# EAGLE design main (EAGLE 7.2.0)
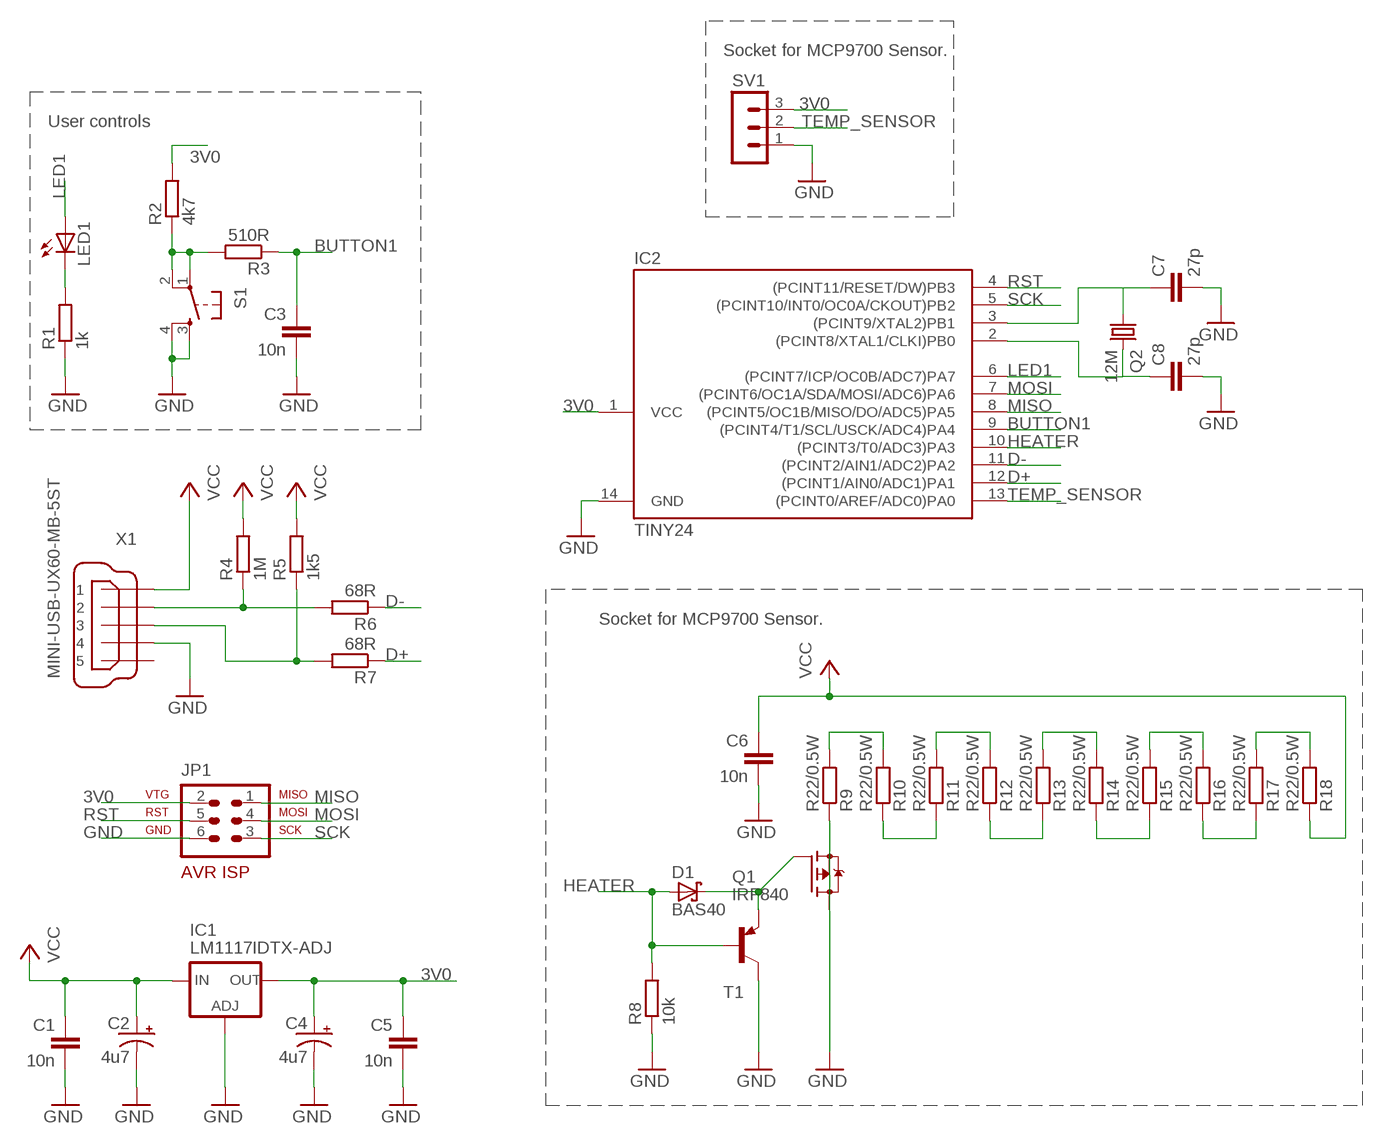
[diagram p0: schematic, sheet 1]

## Parts
C1  10n  C-EUC1206  [C1206]
C2  4u7  CPOL-USA/3216-18W  [A/3216-18W]
C3  10n  C-EUC1206  [C1206]
C4  4u7  CPOL-USA/3216-18W  [A/3216-18W]
C5  10n  C-EUC1206  [C1206]
C6  10n  C-EUC1206  [C1206]
C7  27p  C-EU025-024X044  [C025-024X044]
C8  27p  C-EU025-024X044  [C025-024X044]
D1  BAS40  [SOT23]
IC1  LM1117IDTX-ADJ  [TO252]
IC2  TINY24  TINY24/44/84-PU  [DIL14]
JP1  AVR-ISP-6  [AVR-ISP-6]
LED1  LEDCHIP-LED0805  [CHIP-LED0805]
Q1  IRF840  SPD30P06PTO252  [TO252]
Q2  12M  CRYTALHC18U-V  [HC18U-V]
R1  1k  R-EU_R1206  [R1206]
R2  4k7  R-EU_R1206  [R1206]
R3  510R  R-EU_R1206  [R1206]
R4  1M  R-EU_R1206  [R1206]
R5  1k5  R-EU_R1206  [R1206]
R6  68R  R-EU_R1206  [R1206]
R7  68R  R-EU_R1206  [R1206]
R8  10k  R-EU_R1206  [R1206]
R9  R22/0.5W  R-EU_0207/12  [0207/12]
R10  R22/0.5W  R-EU_0207/12  [0207/12]
R11  R22/0.5W  R-EU_0207/12  [0207/12]
R12  R22/0.5W  R-EU_0207/12  [0207/12]
R13  R22/0.5W  R-EU_0207/12  [0207/12]
R14  R22/0.5W  R-EU_0207/12  [0207/12]
R15  R22/0.5W  R-EU_0207/12  [0207/12]
R16  R22/0.5W  R-EU_0207/12  [0207/12]
R17  R22/0.5W  R-EU_0207/12  [0207/12]
R18  R22/0.5W  R-EU_0207/12  [0207/12]
S1  TAC_SWITCHPTH  [TACTILE-PTH]
SV1  MA03-1  [MA03-1]
T1  BC807-40-PNP-SOT23-BEC  [SOT23-BEC]
X1  MINI-USB-UX60-MB-5ST  [UX60-MB-5ST]

## Nets
3V0: C4.+ C5.1 IC1.TAB(OUT) IC2.1(VCC) JP1.2 R2.2 SV1.3
BUTTON1: C3.1 IC2.9((PCINT4/T1/SCL/USCK/ADC4)PA4) R3.1
D+: IC2.12((PCINT1/AIN0/ADC1)PA1) R7.1
D-: IC2.11((PCINT2/AIN1/ADC2)PA2) R6.1
GND: C1.2 C2.- C3.2 C4.- C5.2 C6.2 C7.2 C8.2 IC1.1(ADJ) IC2.14(GND) JP1.6 Q1.2(S) R1.1 R8.1 S1.3 S1.4 SV1.1 T1.C X1.4
HEATER: D1.1(A) IC2.10((PCINT3/T0/ADC3)PA3) R8.2 T1.B
LED1: IC2.6((PCINT7/ICP/OC0B/ADC7)PA7) LED1.A
MISO: IC2.8((PCINT5/OC1B/MISO/DO/ADC5)PA5) JP1.1
MOSI: IC2.7((PCINT6/OC1A/SDA/MOSI/ADC6)PA6) JP1.4
N$1: R4.1 R6.2 X1.2
N$2: Q1.3(D) R9.1
N$3: R5.1 R7.2 X1.3
N$4: C7.1 IC2.3((PCINT9/XTAL2)PB1) Q2.1
N$5: R9.2 R10.2
N$6: R2.1 R3.2 S1.1 S1.2
N$7: R10.1 R11.1
N$8: R11.2 R12.2
N$9: R12.1 R13.1
N$10: R13.2 R14.2
N$11: R14.1 R15.1
N$12: R15.2 R16.2
N$13: R16.1 R17.1
N$14: LED1.C R1.2
N$16: D1.3(C) Q1.1(G) T1.E
N$17: R17.2 R18.2
PB0: C8.1 IC2.2((PCINT8/XTAL1/CLKI)PB0) Q2.2
RST: IC2.4((PCINT11/RESET/DW)PB3) JP1.5
SCK: IC2.5((PCINT10/INT0/OC0A/CKOUT)PB2) JP1.3
TEMP_SENSOR: IC2.13((PCINT0/AREF/ADC0)PA0) SV1.2
VCC: C1.1 C2.+ C6.1 IC1.2(IN) R4.2 R5.2 R18.1 X1.1
Unconnected: X1.5

## Notes on the sheet
- Socket for MCP9700 Sensor.
- User controls
- Socket for MCP9700 Sensor.

## Library data of the parts
C1 C3 C5-C8 = resistor:C-EU: CAPACITOR, European symbol
C2 C4 = resistor:CPOL-US: POLARIZED CAPACITOR, American symbol
D1 = diode:BAS40: Silicon Schottky Diodes General-purpose diode for high-speed switching
IC1 = lm1117:LM1117IDTX-ADJ
IC2 = avr-5:TINY24/44/84
JP1 = avr-5:AVR-ISP-6: AVR ISP-6 Serial Programming Header
LED1 = led:LED: LED OSRAM: - CHIPLED LG R971, LG N971, LY N971, LG Q971, LY Q971, LO R971, LY R971 LH N974, LH R974 LS Q976, LO Q976, LY Q976 LO Q996 - Hyper CHIPLED LW Q18S LB Q993, LB Q99A, LB R99A - SideLED LS A670, LO A670, LY A670, LG A670, LP A670 LB A673, LV A673, LT A673, LW A673 LH A674 LY A675 LS A676, LA A676, LO A676, LY A676, LW A676 LS A679, LY A679, LG A679 - Hyper Micro SIDELED® LS Y876, LA Y876, LO Y876, LY Y876 LT Y87S - SmartLED LW L88C, LW L88S LB L89C, LB L89S, LG L890 LS L89K, LO L89K, LY L89K LS L896, LA L896, LO L896, LY L896 - TOPLED LS T670, LO T670, LY T670, LG T670, LP T670 LSG T670, LSP T670, LSY T670, LOP T670, LYG T670 LG T671, LOG T671, LSG T671 LB T673, LV T673, LT T673, LW T673 LH T674 LS T676, LA T676, LO T676, LY T676, LB T676, LH T676, LSB T676, LW T676 LB T67C, LV T67C, LT T67C, LS T67K, LO T67K, LY T67K, LW E67C LS E67B, LA E67B, LO E67B, LY E67B, LB E67C, LV E67C, LT E67C LW T67C LS T679, LY T679, LG T679 LS T770, LO T770, LY T770, LG T770, LP T770 LB T773, LV T773, LT T773, LW T773 LH T774 LS E675, LA E675, LY E675, LS T675 LS T776, LA T776, LO T776, LY T776, LB T776 LHGB T686 LT T68C, LB T68C - Hyper Mini TOPLED® LB M676 - Mini TOPLED Santana® LG M470 LS M47K, LO M47K, LY M47K Source: http://www.osram.convergy.de LUXEON: - LUMILED® LXK2-PW12-R00, LXK2-PW12-S00, LXK2-PW14-U00, LXK2-PW14-V00 LXK2-PM12-R00, LXK2-PM12-S00, LXK2-PM14-U00 LXK2-PE12-Q00, LXK2-PE12-R00, LXK2-PE12-S00, LXK2-PE14-T00, LXK2-PE14-U00 LXK2-PB12-K00, LXK2-PB12-L00, LXK2-PB12-M00, LXK2-PB14-N00, LXK2-PB14-P00, LXK2-PB14-Q00 LXK2-PR12-L00, LXK2-PR12-M00, LXK2-PR14-Q00, LXK2-PR14-R00 LXK2-PD12-Q00, LXK2-PD12-R00, LXK2-PD12-S00 LXK2-PH12-R00, LXK2-PH12-S00 LXK2-PL12-P00, LXK2-PL12-Q00, LXK2-PL12-R00 Source: www.luxeon.com KINGBRIGHT: KA-3528ASYC Source: www.kingbright.com
Q1 = transistor-fet:SPD30P06P: SIPMOS(R) Power-Transistor P-Channel, Enhancement mode Source: http://www.infineon.com/upload/Document/cmc_upload/documents/012/3615/SPD_U30P06P.pdf
Q2 = crystal:CRYTAL: CRYSTAL
R1-R18 = resistor:R-EU_: RESISTOR, European symbol
S1 = SparkFun:TAC_SWITCH: Momentary Switch Button commonly used for reset or general input. Spark Fun Electronics SKU : COM-00097
SV1 = con-lstb:MA03-1: PIN HEADER; OC_FARNELL: unknown; OC_NEWARK: unknown
T1 = transistor:*-PNP-: PNP Transistror
X1 = con-hirose:MINI-USB-: MINI USB Connector Source: http://www.hirose.co.jp/cataloge_hp/e24000019.pdf; OC_FARNELL: unknown; OC_NEWARK: unknown

## Net classes
1 hv: clearance 0.635 mm

## Board
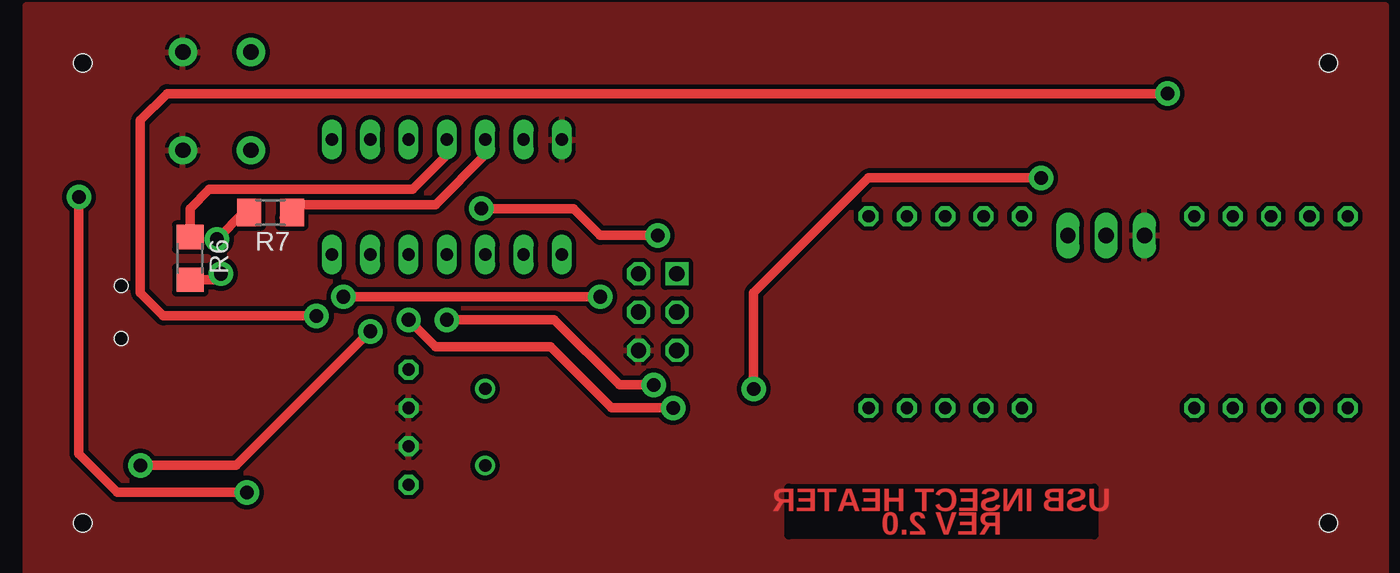
[diagram p1: board, top side]
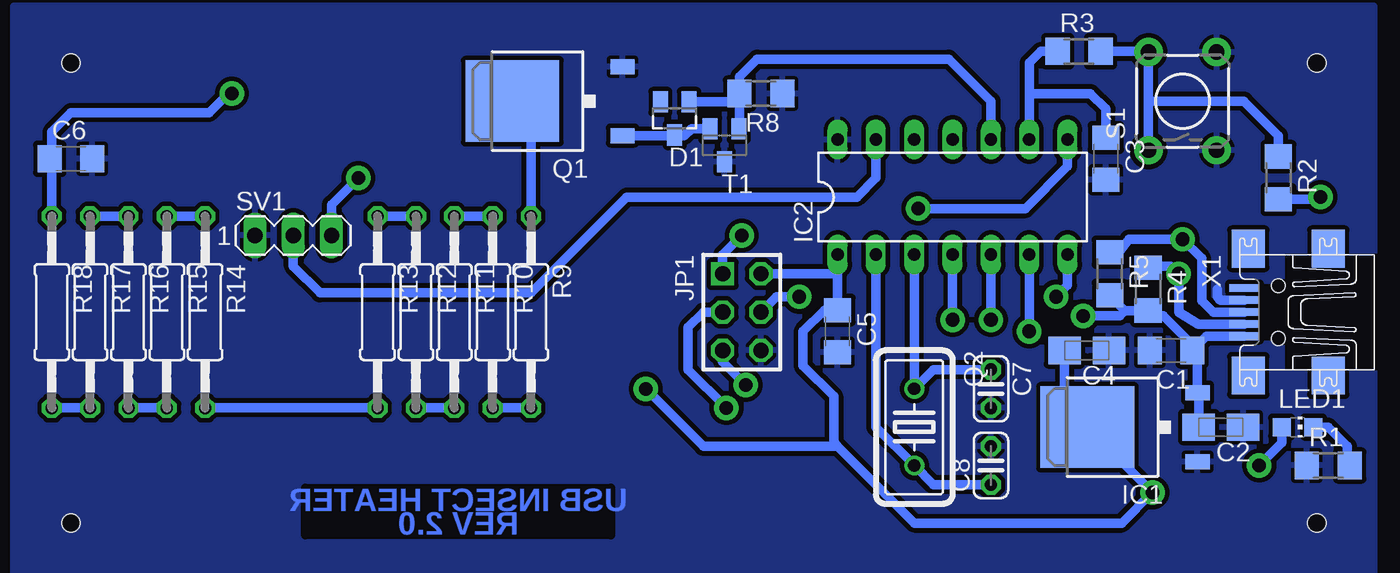
[diagram p2: board, bottom side, seen from below]

No outline drawn. Coordinates in mm, seen from the top.
Copper layers (1*16): Top 0.035mm / dielectric 1.5mm / Bottom 0.035mm
Design rules "default *": minimum track width 10mil, minimum drill 24mil, track to track 12mil, track to pad 12mil, pad to pad 8mil, via to via 8mil, smd to smd 8mil, copper to edge 0mil, drill to drill 8mil, minimum pad ring 10mil, minimum via ring 8mil, stop-mask expansion 4mil, vias tented up to drill 0mil, thermal gap 10mil
Holes 1.2 mm at 3.81,40.64 3.81,10.16 86.36,40.64 86.36,10.16

### Footprints (pad centres in the part's own frame; a part is rotated, then mirrored left to right if it is on the bottom)
C1206 = smd 1.6 x 1.8: 1 -1.4,0; 2 1.4,0
A/3216-18W = smd 2.15 x 1.8: + 1.475,0; - -1.475,0
C025-024X044 = drill 0.813 octagon: 1 -1.27,0; 2 1.27,0
SOT23 = smd 1 x 1.4: 1 -0.95,-1.1; 2 0.95,-1.1; 3 0,1.1
TO252 = smd 1 x 1.6: 1 -2.28,-4.8; 2 2.28,-4.8 | smd 5.4 x 6.2: TAB 0,2.5
DIL14 = drill 0.813 long: 1 -7.62,-3.81; 2 -5.08,-3.81; 3 -2.54,-3.81; 4 0,-3.81; 5 2.54,-3.81; 6 5.08,-3.81; 7 7.62,-3.81; 8 7.62,3.81; 9 5.08,3.81; 10 2.54,3.81; 11 0,3.81; 12 -2.54,3.81; 13 -5.08,3.81; 14 -7.62,3.81
AVR-ISP-6 = drill 1.016 square: 1 -2.54,-1.27 | drill 1.016 octagon: 2 -2.54,1.27; 3 0,-1.27; 4 0,1.27; 5 2.54,-1.27; 6 2.54,1.27
CHIP-LED0805 = smd 1.2 x 1.2: A 0,-1.05; C 0,1.05
TO252' = smd 1 x 1.6: 1 -2.28,-4.8; 2 2.28,-4.8 | smd 5.4 x 6.2: 3 0,2.5
HC18U-V = drill 0.813: 1 -2.54,0; 2 2.54,0
R1206 = smd 1.6 x 1.803: 1 -1.422,0; 2 1.422,0
0207/12 = drill 0.813 octagon: 1 -6.35,0; 2 6.35,0
TACTILE-PTH = drill 1.016 pad 1.88: 1 -3.251,2.261; 2 3.251,2.261; 3 -3.251,-2.261; 4 3.251,-2.261
MA03-1 = drill 1.016 long: 1 -2.54,0; 2 0,0; 3 2.54,0
SOT23-BEC = smd 1 x 1.4: B -0.95,-1.1; C 0,1.1; E 0.95,-1.1
UX60-MB-5ST = smd 2 x 0.5: 1 2.25,1.6; 2 2.25,0.8; 3 2.25,0; 4 2.25,-0.8; 5 2.25,-1.6 | smd 2.2 x 2.5: M1 -3.3,-4.2; M2 -3.3,4.2; M3 2,4.2; M4 2,-4.2 | hole 0.9: 0,-1.75; 0,1.75

### Placement (x,y rotation side)
C1  13.46,21.59 180 bottom
C2  10.16,16.51 180 bottom
C3  17.78,34.29 270 bottom
C4  19.05,21.59 180 bottom
C5  35.56,22.86 270 bottom
C6  86.36,34.29 0 bottom
C7  25.4,19.05 270 bottom
C8  25.4,13.97 90 bottom
D1  46.35,36.96 180 bottom
IC1  16.51,16.51 90 bottom
IC2  27.94,31.75 0 bottom
JP1  41.91,24.13 270 bottom
LED1  5.08,16.51 270 bottom
Q1  IRF840  [TO252']  54.61,38.1 90 bottom
Q2  30.48,16.51 270 bottom
R1  3.05,13.97 0 bottom
R2  6.35,33.02 270 bottom
R3  19.56,41.4 0 bottom
R4  14.99,25.65 270 bottom
R5  17.53,26.67 270 bottom
R6  10.92,27.69 270 top
R7  16.26,30.73 180 top
R8  40.64,38.61 180 bottom
R9  55.88,24.13 270 bottom
R10  58.42,24.13 270 bottom
R11  60.96,24.13 270 bottom
R12  63.5,24.13 270 bottom
R13  66.04,24.13 270 bottom
R14  77.47,24.13 270 bottom
R15  80.01,24.13 270 bottom
R16  82.55,24.13 270 bottom
R17  85.09,24.13 270 bottom
R18  87.63,24.13 270 bottom
S1  12.7,38.1 90 bottom
SV1  71.63,29.21 0 bottom
T1  43.05,35.18 180 bottom
X1  6.35,24.13 180 bottom

### Tracks (layer width: path | path; a pad name or v marks a point on that pad's centre or on a via)
3V0  (via drill 0.9)
  Top 0.635: v3.56,31.75 3.56,14.73 6.1,12.19 v14.69,12.19 | v67.31,33.02 55.88,33.02 48.26,25.4 v48.26,19.05
  Bottom 0.635: C4.+ 20.52,18.02 IC1.TAB v14.69,12.19 16.72,10.16 30.48,10.16 35.56,15.24 | 35.56,26.67 C5.1 36.45,24.26 37.85,22.86 37.85,20.57 35.81,18.54 35.81,15.49 35.56,15.24 | IC2.1 35.56,26.67 | 35.56,26.67 JP1.2 | R2.2 3.71,31.6 v3.56,31.75 | SV1.3 69.09,31.24 v67.31,33.02 | v48.26,19.05 44.45,15.24 35.56,15.24
BUTTON1
  Bottom 0.635: IC2.9 22.86,38.35 | 22.86,38.35 22.86,40.64 22.1,41.4 R3.1 | C3.1 17.78,37.59 18.8,38.61 22.61,38.61 22.86,38.35
D+
  Top 0.635: R7.1 17.17,30.38 18.03,31.24 27.18,31.24 30.48,34.54 IC2.12
D-
  Top 0.635: R6.1 10.92,30.99 12.19,32.26 25.65,32.26 27.94,34.54 IC2.11
GND
  Bottom 0.635: 8.89,16.3 C2.- | X1.4 10.2,24.93 10.41,25.15 10.41,25.65
  pour Bottom: 0,6.35 90.17,6.35 90.17,44.45 0,44.45
  pour Top: 0,6.35 90.17,6.35 90.17,44.45 0,44.45
HEATER
  Bottom 0.635: T1.B 42.06,36.32 42.06,38.1 | 42.06,38.1 R8.2 | R8.2 | D1.1 42.1,38.06 42.06,38.1 | R8.2 42.06,39.73 40.89,40.89 28.19,40.89 25.4,38.1 IC2.10
LED1  (via drill 0.9)
  Top 0.635: v7.62,13.97 13.97,13.97 v22.86,22.86
  Bottom 0.635: IC2.6 v22.86,22.86 | LED1.A 6.13,15.46 v7.62,13.97
MISO  (via drill 0.9)
  Top 0.635: v41.91,29.21 38.1,29.21 36.32,30.99 v30.23,30.99
  Bottom 0.635: JP1.1 43.18,27.94 v41.91,29.21 | v30.23,30.99 23.11,30.99 20.32,33.78 IC2.8
MOSI  (via drill 0.9)
  Top 0.635: v38.1,25.15 v21.08,25.15
  Bottom 0.635: JP1.4 39.62,25.15 v38.1,25.15 | v21.08,25.15 20.32,25.91 IC2.7
N$1  (via drill 0.9)
  Top 0.635: R6.2 12.55,26.26 v12.95,26.67
  Bottom 0.635: X1.2 11.65,23.33 12.95,24.13 v12.95,26.67 13.46,27.18 14.33,27.18 R4.1
N$2
  Bottom 0.635: R9.1 55.88,36.87 Q1.3
N$3  (via drill 0.9)
  Top 0.635: R7.2 14.48,30.73 v12.7,28.96
  Bottom 0.635: X1.3 10.67,24.13 11.43,24.89 11.43,27.69 v12.7,28.96 16.26,28.96 17.02,27.94 R5.1
N$4
  Bottom 0.635: C7.1 29.21,20.32 Q2.1 IC2.3
N$5
  Bottom 0.635: R9.2 R10.2
N$6
  Bottom 0.635: R3.2 15.01,41.4 S1.2 14.96,38.1 | 14.96,38.1 S1.1 | R2.1 6.35,35.81 8.64,38.1 14.96,38.1
N$7
  Bottom 0.635: R10.1 R11.1
N$8
  Bottom 0.635: R11.2 R12.2
N$9
  Bottom 0.635: R12.1 R13.1
N$10
  Bottom 0.635: R13.2 R14.2
N$11
  Bottom 0.635: R14.1 R15.1
N$12
  Bottom 0.635: R15.2 R16.2
N$13
  Bottom 0.635: R16.1 R17.1
N$14
  Bottom 0.635: LED1.C 3.05,16.51 1.78,15.24 1.78,14.12 R1.2
N$16
  Bottom 0.635: T1.E 45.26,36.28 45.72,35.81 46.31,35.81 D1.3 46.4,35.81 47.75,35.81 49.27,35.82 Q1.1
N$17
  Bottom 0.635: R17.2 R18.2
PB0
  Bottom 0.635: C8.1 29.21,12.7 Q2.2 33.02,16.51 IC2.2
RST  (via drill 0.9)
  Top 0.635: v27.94,23.62 35.05,23.62 39.37,19.3 v41.66,19.3
  Bottom 0.635: IC2.4 v27.94,23.62 | v41.66,19.3 43.18,20.83 JP1.5
SCK  (via drill 0.9)
  Top 0.635: v25.4,23.62 27.18,21.84 34.8,21.84 38.86,17.78 v42.93,17.78
  Bottom 0.635: IC2.5 v25.4,23.62 | v42.93,17.78 45.47,20.32 45.47,23.11 44.45,24.13 JP1.3
TEMP_SENSOR
  Bottom 0.635: IC2.13 33.02,33.02 34.29,31.75 49.53,31.75 55.88,25.4 69.85,25.4 71.63,27.18 SV1.2
VCC  (via drill 0.9)
  Top 0.635: v19.3,23.88 9.14,23.88 7.62,25.4 7.62,36.83 9.4,38.61 v75.69,38.61
  Bottom 0.635: X1.1 11.12,22.53 C1.1 | C2.+ 11.63,18.71 IC1.2 11.71,21.24 C1.1 | C1.1 12.06,22.07 12.16,22.07 13.97,23.88 14.63,23.88 R4.2 16.51,24.23 | R18.1 87.63,34.16 C6.1 87.63,34.42 87.63,36.07 86.36,37.34 77.22,37.34 75.95,38.61 v75.69,38.61 | 16.51,24.23 R5.2 | v19.3,23.88 16.87,23.88 16.51,24.23

### Text on the board
Top: USB INSECT HEATER / REV 2.0
Bottom: USB INSECT HEATER / REV 2.0